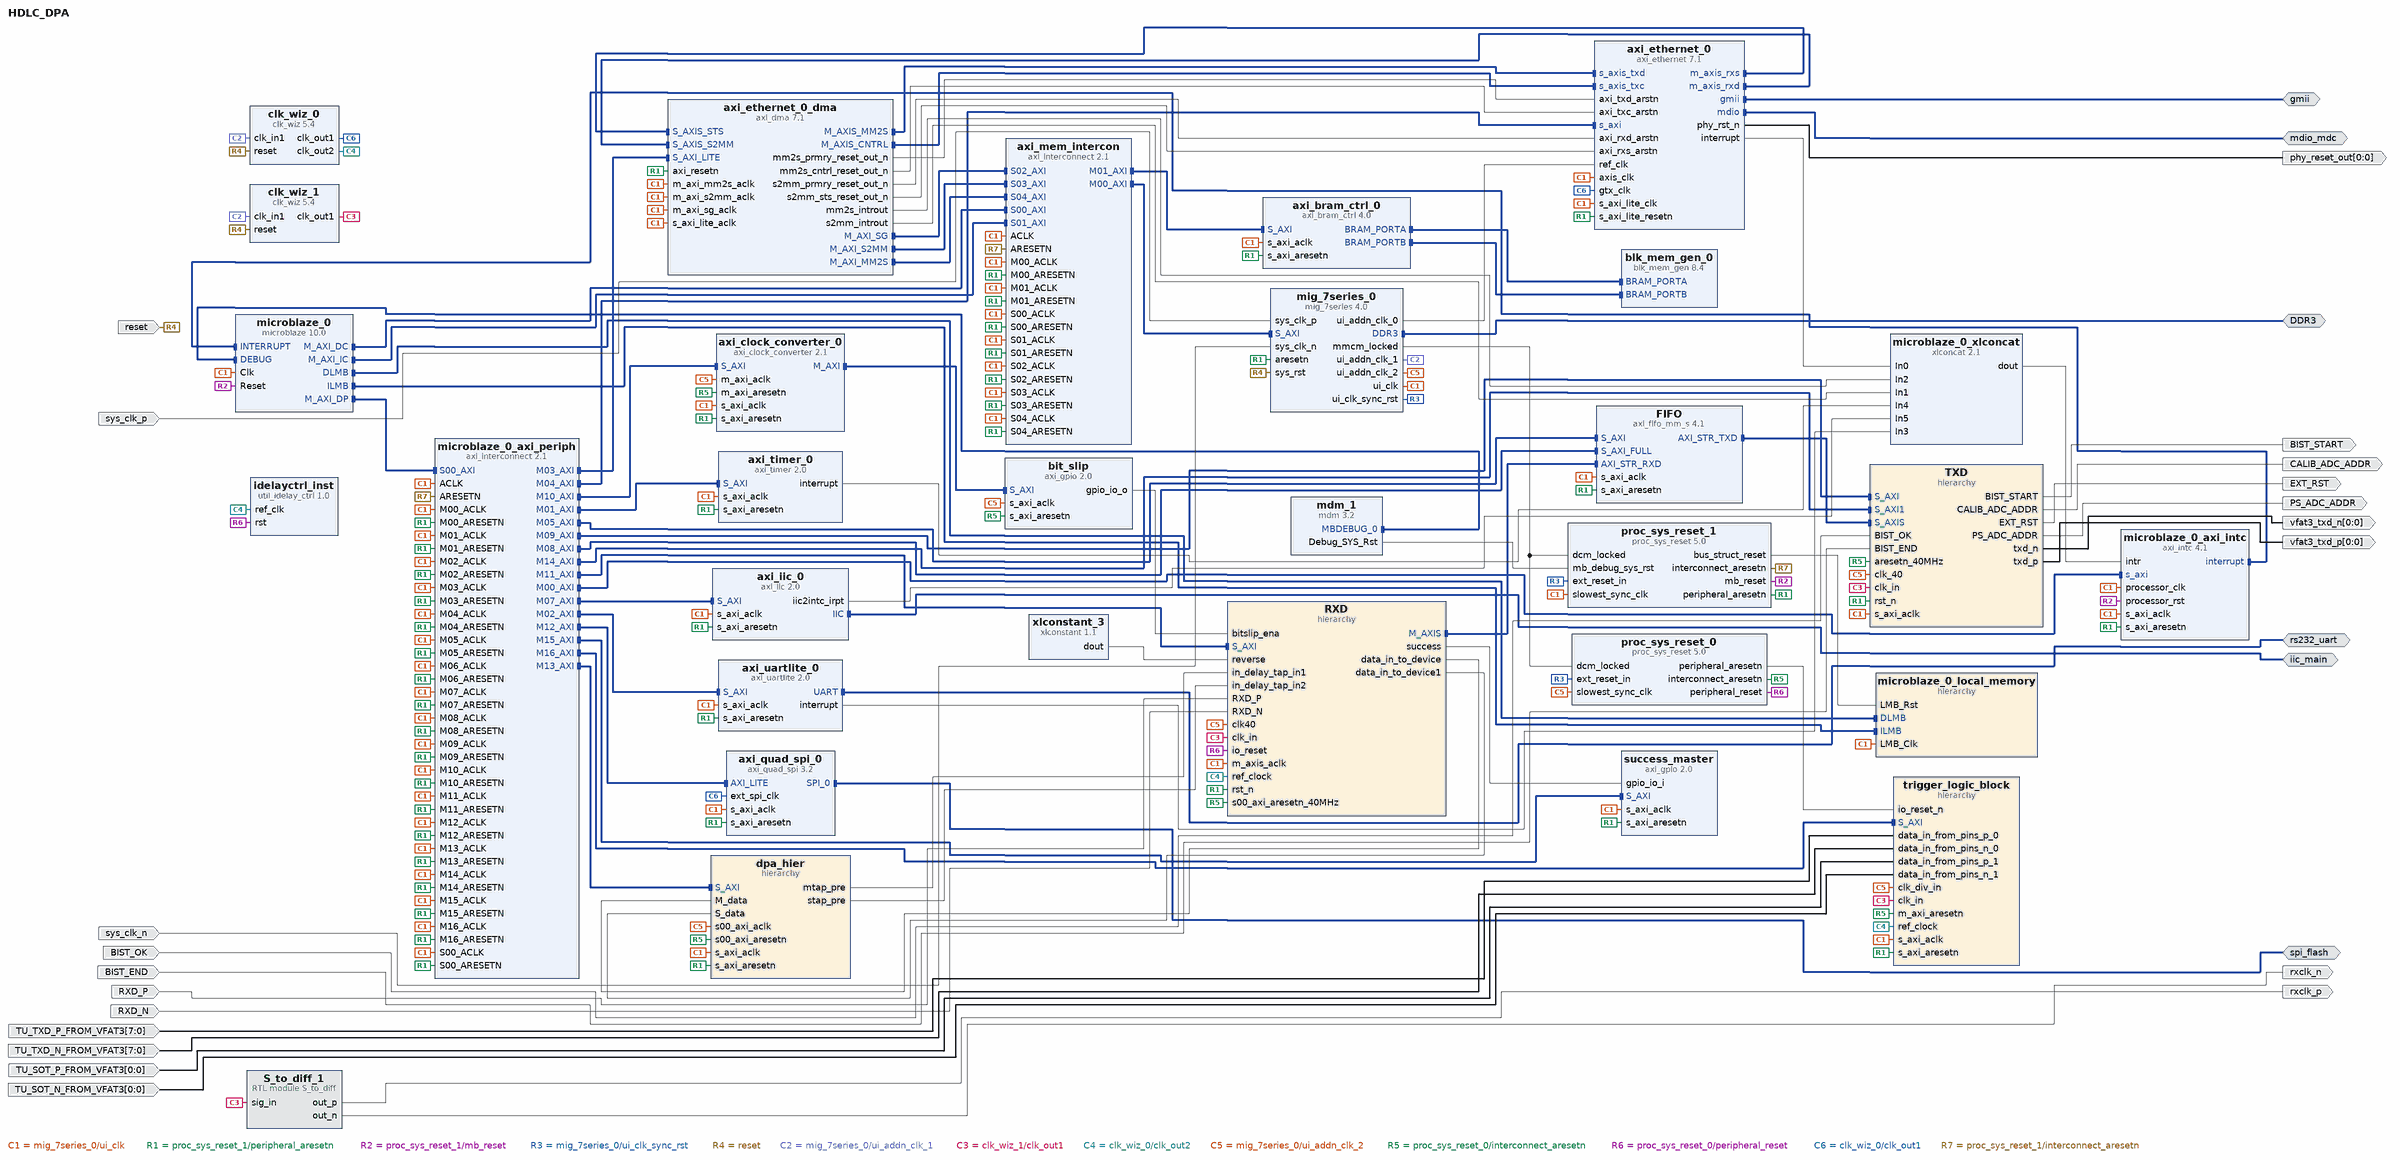
[diagram p0: block diagram of the top level]
# Vivado block design HDLC_DPA, xc7k325tffg900-2, Vivado 2017.4
create_bd_design HDLC_DPA

create_bd_intf_port -mode Master -vlnv xilinx.com:interface:uart_rtl:1.0 rs232_uart
create_bd_intf_port -mode Master -vlnv xilinx.com:interface:ddrx_rtl:1.0 DDR3
create_bd_intf_port -mode Master -vlnv xilinx.com:interface:gmii_rtl:1.0 gmii
create_bd_intf_port -mode Master -vlnv xilinx.com:interface:mdio_rtl:1.0 mdio_mdc
create_bd_intf_port -mode Master -vlnv xilinx.com:interface:iic_rtl:1.0 iic_main
create_bd_intf_port -mode Master -vlnv xilinx.com:interface:spi_rtl:1.0 spi_flash
create_bd_port -dir I sys_clk_p
create_bd_port -dir I sys_clk_n
create_bd_port -dir I -type rst reset
set_property -dict {CONFIG.POLARITY ACTIVE_HIGH} [get_bd_ports reset]
create_bd_port -dir O -from 0 -to 0 -type rst phy_reset_out
create_bd_port -dir O -from 0 -to 0 vfat3_txd_p
create_bd_port -dir O -from 0 -to 0 vfat3_txd_n
create_bd_port -dir I BIST_OK
create_bd_port -dir I BIST_END
create_bd_port -dir O BIST_START
create_bd_port -dir O PS_ADC_ADDR
create_bd_port -dir O CALIB_ADC_ADDR
create_bd_port -dir O EXT_RST
create_bd_port -dir O rxclk_p
create_bd_port -dir O rxclk_n
create_bd_port -dir I RXD_P
create_bd_port -dir I RXD_N
create_bd_port -dir I -from 7 -to 0 TU_TXD_P_FROM_VFAT3
create_bd_port -dir I -from 7 -to 0 TU_TXD_N_FROM_VFAT3
create_bd_port -dir I -from 0 -to 0 TU_SOT_P_FROM_VFAT3
create_bd_port -dir I -from 0 -to 0 TU_SOT_N_FROM_VFAT3

create_bd_cell -type hier microblaze_0_local_memory
create_bd_cell -type ip -vlnv xilinx.com:ip:axi_intc:4.1 microblaze_0_axi_intc
set_property -dict {CONFIG.C_HAS_FAST 1} [get_bd_cells microblaze_0_axi_intc]
create_bd_cell -type ip -vlnv xilinx.com:ip:xlconcat:2.1 microblaze_0_xlconcat
set_property -dict {CONFIG.NUM_PORTS 6 CONFIG.dout_width 6} [get_bd_cells microblaze_0_xlconcat]
create_bd_cell -type ip -vlnv xilinx.com:ip:axi_bram_ctrl:4.0 axi_bram_ctrl_0
set_property -dict {CONFIG.C_SELECT_XPM 0} [get_bd_cells axi_bram_ctrl_0]
create_bd_cell -type ip -vlnv xilinx.com:ip:axi_clock_converter:2.1 axi_clock_converter_0
create_bd_cell -type ip -vlnv xilinx.com:ip:axi_ethernet:7.1 axi_ethernet_0
set_property -dict [list \
  CONFIG.ETHERNET_BOARD_INTERFACE gmii \
  CONFIG.PHYRST_BOARD_INTERFACE phy_reset_out \
  CONFIG.MDIO_BOARD_INTERFACE mdio_mdc \
  CONFIG.rxnibblebitslice0used true \
  CONFIG.RXMEM 32k \
  CONFIG.TXMEM 32k \
  CONFIG.TXCSUM Full \
  CONFIG.RXCSUM Full \
] [get_bd_cells axi_ethernet_0]
create_bd_cell -type ip -vlnv xilinx.com:ip:axi_dma:7.1 axi_ethernet_0_dma
set_property -dict [list \
  CONFIG.c_include_mm2s_dre 1 \
  CONFIG.c_mm2s_burst_size 32 \
  CONFIG.c_sg_use_stsapp_length 1 \
  CONFIG.c_include_s2mm_dre 1 \
  CONFIG.c_s2mm_burst_size 32 \
] [get_bd_cells axi_ethernet_0_dma]
create_bd_cell -type ip -vlnv xilinx.com:ip:axi_fifo_mm_s:4.1 FIFO
set_property -dict [list \
  CONFIG.C_DATA_INTERFACE_TYPE 1 \
  CONFIG.C_RX_FIFO_PE_THRESHOLD 2 \
  CONFIG.C_RX_FIFO_PF_THRESHOLD 32763 \
  CONFIG.C_TX_FIFO_PE_THRESHOLD 2 \
  CONFIG.C_TX_FIFO_PF_THRESHOLD 130000 \
  CONFIG.C_RX_FIFO_DEPTH 32768 \
  CONFIG.C_TX_FIFO_DEPTH 131072 \
  CONFIG.C_HAS_AXIS_TDEST false \
  CONFIG.C_AXIS_TDEST_WIDTH 4 \
  CONFIG.C_USE_TX_DATA 1 \
  CONFIG.C_USE_TX_CTRL 0 \
] [get_bd_cells FIFO]
create_bd_cell -type ip -vlnv xilinx.com:ip:axi_gpio:2.0 bit_slip
set_property -dict {CONFIG.C_GPIO_WIDTH 1 CONFIG.C_ALL_OUTPUTS 1} [get_bd_cells bit_slip]
create_bd_cell -type ip -vlnv xilinx.com:ip:axi_iic:2.0 axi_iic_0
set_property -dict {CONFIG.USE_BOARD_FLOW true CONFIG.IIC_BOARD_INTERFACE iic_main} [get_bd_cells axi_iic_0]
create_bd_cell -type ip -vlnv xilinx.com:ip:axi_interconnect:2.1 axi_mem_intercon
set_property -dict [list \
  CONFIG.NUM_SI 5 \
  CONFIG.NUM_MI 2 \
  CONFIG.STRATEGY 2 \
  CONFIG.SYNCHRONIZATION_STAGES 2 \
  CONFIG.M00_HAS_REGSLICE 4 \
  CONFIG.M01_HAS_REGSLICE 4 \
  CONFIG.S00_HAS_REGSLICE 4 \
  CONFIG.S01_HAS_REGSLICE 4 \
  CONFIG.S02_HAS_REGSLICE 4 \
  CONFIG.S03_HAS_REGSLICE 4 \
  CONFIG.S04_HAS_REGSLICE 4 \
  CONFIG.S00_HAS_DATA_FIFO 2 \
  CONFIG.S01_HAS_DATA_FIFO 2 \
  CONFIG.S02_HAS_DATA_FIFO 2 \
  CONFIG.S03_HAS_DATA_FIFO 2 \
  CONFIG.S04_HAS_DATA_FIFO 2 \
] [get_bd_cells axi_mem_intercon]
create_bd_cell -type ip -vlnv xilinx.com:ip:axi_timer:2.0 axi_timer_0
create_bd_cell -type ip -vlnv xilinx.com:ip:axi_uartlite:2.0 axi_uartlite_0
set_property -dict [list \
  CONFIG.C_BAUDRATE 921600 \
  CONFIG.C_S_AXI_ACLK_FREQ_HZ 150150150 \
  CONFIG.USE_BOARD_FLOW true \
  CONFIG.UARTLITE_BOARD_INTERFACE rs232_uart \
] [get_bd_cells axi_uartlite_0]
create_bd_cell -type ip -vlnv xilinx.com:ip:blk_mem_gen:8.4 blk_mem_gen_0
set_property -dict [list \
  CONFIG.Memory_Type True_Dual_Port_RAM \
  CONFIG.Enable_B Use_ENB_Pin \
  CONFIG.Use_RSTB_Pin true \
  CONFIG.Port_B_Clock 100 \
  CONFIG.Port_B_Write_Rate 50 \
  CONFIG.Port_B_Enable_Rate 100 \
  CONFIG.EN_SAFETY_CKT false \
] [get_bd_cells blk_mem_gen_0]
create_bd_cell -type ip -vlnv xilinx.com:ip:clk_wiz:5.4 clk_wiz_0
set_property -dict [list \
  CONFIG.CLKIN1_JITTER_PS 83.329999999999998 \
  CONFIG.CLKOUT2_USED true \
  CONFIG.NUM_OUT_CLKS 2 \
  CONFIG.CLKOUT1_REQUESTED_OUT_FREQ 125 \
  CONFIG.CLKOUT2_REQUESTED_OUT_FREQ 200 \
  CONFIG.MMCM_DIVCLK_DIVIDE 3 \
  CONFIG.MMCM_CLKFBOUT_MULT_F 25.000 \
  CONFIG.MMCM_CLKIN1_PERIOD 8.333 \
  CONFIG.MMCM_CLKIN2_PERIOD 10.000 \
  CONFIG.MMCM_CLKOUT0_DIVIDE_F 8.000 \
  CONFIG.MMCM_CLKOUT1_DIVIDE 5 \
  CONFIG.USE_BOARD_FLOW true \
  CONFIG.RESET_BOARD_INTERFACE reset \
  CONFIG.CLKOUT1_JITTER 165.993 \
  CONFIG.CLKOUT1_PHASE_ERROR 191.950 \
  CONFIG.CLKOUT2_JITTER 153.008 \
  CONFIG.CLKOUT2_PHASE_ERROR 191.950 \
] [get_bd_cells clk_wiz_0]
create_bd_cell -type ip -vlnv xilinx.com:ip:clk_wiz:5.4 clk_wiz_1
set_property -dict [list \
  CONFIG.CLKIN1_JITTER_PS 83.329999999999998 \
  CONFIG.CLKOUT2_USED true \
  CONFIG.CLKOUT3_USED true \
  CONFIG.CLKOUT4_USED true \
  CONFIG.NUM_OUT_CLKS 4 \
  CONFIG.CLKOUT1_REQUESTED_OUT_FREQ 320 \
  CONFIG.CLKOUT2_REQUESTED_OUT_FREQ 320 \
  CONFIG.CLKOUT2_REQUESTED_PHASE 0 \
  CONFIG.CLKOUT3_REQUESTED_OUT_FREQ 40 \
  CONFIG.CLKOUT4_REQUESTED_OUT_FREQ 200 \
  CONFIG.PRIM_SOURCE Single_ended_clock_capable_pin \
  CONFIG.MMCM_DIVCLK_DIVIDE 1 \
  CONFIG.MMCM_CLKFBOUT_MULT_F 8.000 \
  CONFIG.MMCM_CLKIN1_PERIOD 8.333 \
  CONFIG.MMCM_CLKIN2_PERIOD 10.000 \
  CONFIG.MMCM_CLKOUT0_DIVIDE_F 3.000 \
  CONFIG.MMCM_CLKOUT1_DIVIDE 3 \
  CONFIG.MMCM_CLKOUT1_PHASE 0.000 \
  CONFIG.MMCM_CLKOUT2_DIVIDE 24 \
  CONFIG.MMCM_CLKOUT3_DIVIDE 5 \
  CONFIG.USE_BOARD_FLOW true \
  CONFIG.CLK_IN1_BOARD_INTERFACE Custom \
  CONFIG.RESET_BOARD_INTERFACE reset \
  CONFIG.CLKOUT1_JITTER 102.742 \
  CONFIG.CLKOUT1_PHASE_ERROR 99.820 \
  CONFIG.CLKOUT2_JITTER 102.742 \
  CONFIG.CLKOUT2_PHASE_ERROR 99.820 \
  CONFIG.CLKOUT3_JITTER 154.911 \
  CONFIG.CLKOUT3_PHASE_ERROR 99.820 \
  CONFIG.CLKOUT4_JITTER 113.061 \
  CONFIG.CLKOUT4_PHASE_ERROR 99.820 \
] [get_bd_cells clk_wiz_1]
create_bd_cell -type ip -vlnv xilinx.com:ip:mdm:3.2 mdm_1
create_bd_cell -type ip -vlnv xilinx.com:ip:microblaze:10.0 microblaze_0
set_property -dict [list \
  CONFIG.C_AREA_OPTIMIZED 0 \
  CONFIG.C_D_AXI 1 \
  CONFIG.C_I_AXI 0 \
  CONFIG.C_ENABLE_DISCRETE_PORTS 0 \
  CONFIG.G_TEMPLATE_LIST 3 \
  CONFIG.G_USE_EXCEPTIONS 0 \
  CONFIG.C_USE_MSR_INSTR 1 \
  CONFIG.C_USE_PCMP_INSTR 1 \
  CONFIG.C_USE_BARREL 1 \
  CONFIG.C_USE_DIV 1 \
  CONFIG.C_USE_HW_MUL 2 \
  CONFIG.C_USE_FPU 2 \
  CONFIG.C_DEBUG_ENABLED 1 \
  CONFIG.C_FSL_LINKS 1 \
  CONFIG.C_USE_EXTENDED_FSL_INSTR 1 \
  CONFIG.C_USE_ICACHE 1 \
  CONFIG.C_ADDR_TAG_BITS 19 \
  CONFIG.C_CACHE_BYTE_SIZE 4096 \
  CONFIG.C_ICACHE_LINE_LEN 4 \
  CONFIG.C_ICACHE_VICTIMS 0 \
  CONFIG.C_ICACHE_STREAMS 0 \
  CONFIG.C_USE_DCACHE 1 \
  CONFIG.C_DCACHE_ADDR_TAG 19 \
  CONFIG.C_DCACHE_BYTE_SIZE 4096 \
  CONFIG.C_DCACHE_LINE_LEN 4 \
  CONFIG.C_DCACHE_USE_WRITEBACK 0 \
  CONFIG.C_USE_MMU 3 \
  CONFIG.C_MMU_DTLB_SIZE 2 \
  CONFIG.C_MMU_ITLB_SIZE 1 \
  CONFIG.C_MMU_ZONES 2 \
  CONFIG.C_USE_BRANCH_TARGET_CACHE 1 \
] [get_bd_cells microblaze_0]
create_bd_cell -type ip -vlnv xilinx.com:ip:axi_interconnect:2.1 microblaze_0_axi_periph
set_property -dict {CONFIG.NUM_SI 1 CONFIG.NUM_MI 17 CONFIG.SYNCHRONIZATION_STAGES 2} [get_bd_cells microblaze_0_axi_periph]
create_bd_cell -type ip -vlnv xilinx.com:ip:mig_7series:4.0 mig_7series_0
set_property -dict [list \
  CONFIG.XML_INPUT_FILE mig_b.prj \
  CONFIG.RESET_BOARD_INTERFACE reset \
  CONFIG.MIG_DONT_TOUCH_PARAM Custom \
  CONFIG.BOARD_MIG_PARAM Custom \
] [get_bd_cells mig_7series_0]
create_bd_cell -type ip -vlnv xilinx.com:ip:proc_sys_reset:5.0 proc_sys_reset_1
create_bd_cell -type ip -vlnv xilinx.com:ip:xlconstant:1.1 xlconstant_3
create_bd_cell -type ip -vlnv xilinx.com:ip:axi_quad_spi:3.2 axi_quad_spi_0
set_property -dict {CONFIG.USE_BOARD_FLOW true CONFIG.QSPI_BOARD_INTERFACE spi_flash} [get_bd_cells axi_quad_spi_0]
create_bd_cell -type hier RXD
create_bd_cell -type hier TXD
create_bd_cell -type ip -vlnv xilinx.com:ip:proc_sys_reset:5.0 proc_sys_reset_0
create_bd_cell -type module -reference S_to_diff S_to_diff_1
create_bd_cell -type hier dpa_hier
create_bd_cell -type ip -vlnv xilinx.com:ip:axi_gpio:2.0 success_master
set_property -dict {CONFIG.C_GPIO_WIDTH 1 CONFIG.C_ALL_INPUTS 1} [get_bd_cells success_master]
create_bd_cell -type hier trigger_logic_block
create_bd_cell -type ip -vlnv xilinx.com:ip:util_idelay_ctrl:1.0 idelayctrl_inst

# ---- hierarchy /microblaze_0_local_memory ----
current_bd_instance /microblaze_0_local_memory
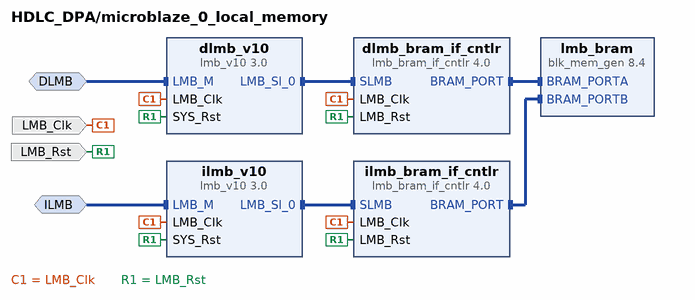
[diagram p1: block diagram inside /microblaze_0_local_memory]
create_bd_intf_pin -mode MirroredMaster -vlnv xilinx.com:interface:lmb_rtl:1.0 DLMB
create_bd_intf_pin -mode MirroredMaster -vlnv xilinx.com:interface:lmb_rtl:1.0 ILMB
create_bd_pin -dir I LMB_Clk
create_bd_pin -dir I LMB_Rst

create_bd_cell -type ip -vlnv xilinx.com:ip:lmb_v10:3.0 dlmb_v10
create_bd_cell -type ip -vlnv xilinx.com:ip:lmb_v10:3.0 ilmb_v10
create_bd_cell -type ip -vlnv xilinx.com:ip:lmb_bram_if_cntlr:4.0 dlmb_bram_if_cntlr
create_bd_cell -type ip -vlnv xilinx.com:ip:lmb_bram_if_cntlr:4.0 ilmb_bram_if_cntlr
create_bd_cell -type ip -vlnv xilinx.com:ip:blk_mem_gen:8.4 lmb_bram
set_property -dict [list \
  CONFIG.Memory_Type True_Dual_Port_RAM \
  CONFIG.Enable_B Use_ENB_Pin \
  CONFIG.Use_RSTB_Pin true \
  CONFIG.Port_B_Clock 100 \
  CONFIG.Port_B_Write_Rate 50 \
  CONFIG.Port_B_Enable_Rate 100 \
  CONFIG.EN_SAFETY_CKT false \
] [get_bd_cells lmb_bram]

# ---- hierarchy /RXD ----
current_bd_instance /RXD
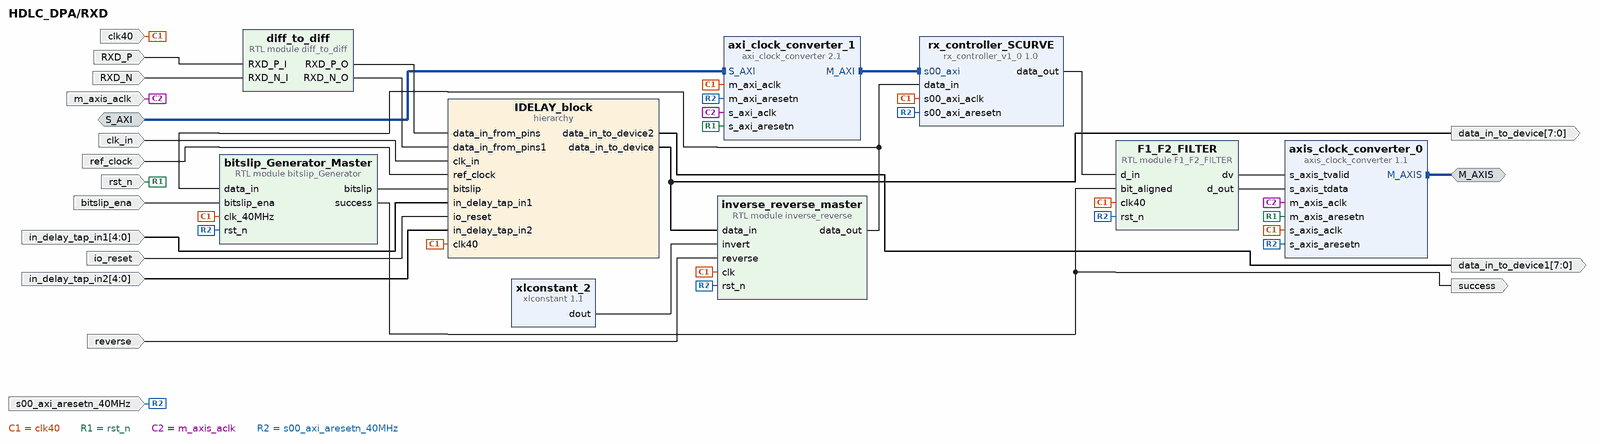
[diagram p2: block diagram inside /RXD]
create_bd_intf_pin -mode Master -vlnv xilinx.com:interface:axis_rtl:1.0 M_AXIS
create_bd_intf_pin -mode Slave -vlnv xilinx.com:interface:aximm_rtl:1.0 S_AXI
create_bd_pin -dir I clk40
create_bd_pin -dir I -type rst rst_n
create_bd_pin -dir I reverse
create_bd_pin -dir O success
create_bd_pin -dir I -type clk clk_in
create_bd_pin -dir I ref_clock
create_bd_pin -dir I RXD_P
create_bd_pin -dir I RXD_N
create_bd_pin -dir I bitslip_ena
create_bd_pin -dir I -type clk m_axis_aclk
create_bd_pin -dir I -type rst s00_axi_aresetn_40MHz
create_bd_pin -dir O -from 7 -to 0 -type data data_in_to_device
create_bd_pin -dir I -from 4 -to 0 in_delay_tap_in1
create_bd_pin -dir I -type rst io_reset
create_bd_pin -dir O -from 7 -to 0 -type data data_in_to_device1
create_bd_pin -dir I -from 4 -to 0 in_delay_tap_in2

create_bd_cell -type module -reference inverse_reverse inverse_reverse_master
create_bd_cell -type module -reference diff_to_diff diff_to_diff
create_bd_cell -type ip -vlnv xilinx.com:ip:axis_clock_converter:1.1 axis_clock_converter_0
set_property -dict {CONFIG.TDATA_NUM_BYTES 4} [get_bd_cells axis_clock_converter_0]
create_bd_cell -type ip -vlnv xilinx.com:ip:axi_clock_converter:2.1 axi_clock_converter_1
create_bd_cell -type hier IDELAY_block
create_bd_cell -type ip -vlnv xilinx.com:ip:xlconstant:1.1 xlconstant_2
set_property -dict {CONFIG.CONST_VAL 0} [get_bd_cells xlconstant_2]
create_bd_cell -type ip -vlnv cern.ch:user:rx_controller_v1_0:1.0 rx_controller_SCURVE
create_bd_cell -type module -reference bitslip_Generator bitslip_Generator_Master
create_bd_cell -type module -reference F1_F2_FILTER F1_F2_FILTER

# ---- hierarchy /RXD/IDELAY_block ----
current_bd_instance /RXD/IDELAY_block
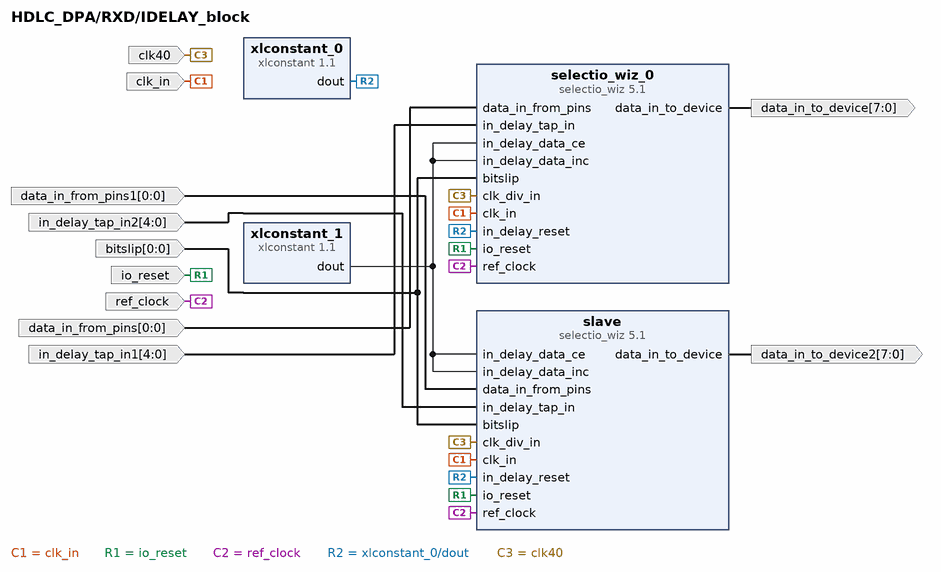
[diagram p3: block diagram inside /RXD/IDELAY_block]
create_bd_pin -dir I -from 0 -to 0 data_in_from_pins
create_bd_pin -dir I -type clk clk_in
create_bd_pin -dir I clk40
create_bd_pin -dir I -type rst io_reset
create_bd_pin -dir I ref_clock
create_bd_pin -dir I -from 0 -to 0 bitslip
create_bd_pin -dir O -from 7 -to 0 -type data data_in_to_device
create_bd_pin -dir I -from 4 -to 0 in_delay_tap_in1
create_bd_pin -dir I -from 0 -to 0 data_in_from_pins1
create_bd_pin -dir I -from 4 -to 0 in_delay_tap_in2
create_bd_pin -dir O -from 7 -to 0 -type data data_in_to_device2

create_bd_cell -type ip -vlnv xilinx.com:ip:xlconstant:1.1 xlconstant_0
create_bd_cell -type ip -vlnv xilinx.com:ip:selectio_wiz:5.1 slave
set_property -dict [list \
  CONFIG.BUS_IO_STD LVCMOS25 \
  CONFIG.USE_SERIALIZATION true \
  CONFIG.SERIALIZATION_FACTOR 8 \
  CONFIG.SYSTEM_DATA_WIDTH 1 \
  CONFIG.SELIO_INTERFACE_TYPE NETWORKING \
  CONFIG.SELIO_BUS_IN_DELAY VAR_LOADABLE \
  CONFIG.SELIO_CLK_IO_STD LVCMOS25 \
  CONFIG.SELIO_CLK_BUF MMCM \
  CONFIG.CLK_FWD_IO_STD LVCMOS25 \
  CONFIG.INCLUDE_IDELAYCTRL true \
  CONFIG.INCLUDE_IDELAYCTRL_BUFG false \
  CONFIG.IDELAY_HIGH_PERF_MODE true \
] [get_bd_cells slave]
create_bd_cell -type ip -vlnv xilinx.com:ip:xlconstant:1.1 xlconstant_1
set_property -dict {CONFIG.CONST_VAL 0} [get_bd_cells xlconstant_1]
create_bd_cell -type ip -vlnv xilinx.com:ip:selectio_wiz:5.1 selectio_wiz_0
set_property -dict [list \
  CONFIG.BUS_IO_STD LVCMOS25 \
  CONFIG.USE_SERIALIZATION true \
  CONFIG.SERIALIZATION_FACTOR 8 \
  CONFIG.SYSTEM_DATA_WIDTH 1 \
  CONFIG.SELIO_INTERFACE_TYPE NETWORKING \
  CONFIG.SELIO_BUS_IN_DELAY VAR_LOADABLE \
  CONFIG.SELIO_CLK_IO_STD LVCMOS25 \
  CONFIG.SELIO_CLK_BUF MMCM \
  CONFIG.CLK_FWD_IO_STD LVCMOS25 \
] [get_bd_cells selectio_wiz_0]

# ---- hierarchy /TXD ----
current_bd_instance /TXD
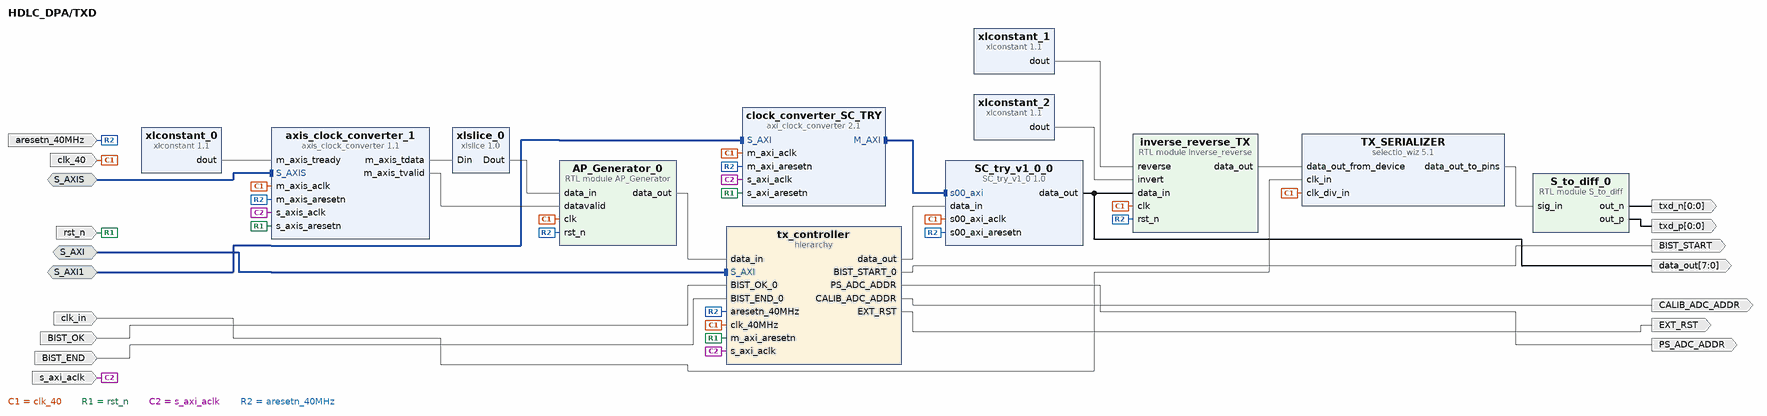
[diagram p4: block diagram inside /TXD]
create_bd_intf_pin -mode Slave -vlnv xilinx.com:interface:axis_rtl:1.0 S_AXIS
create_bd_intf_pin -mode Slave -vlnv xilinx.com:interface:aximm_rtl:1.0 S_AXI
create_bd_intf_pin -mode Slave -vlnv xilinx.com:interface:aximm_rtl:1.0 S_AXI1
create_bd_pin -dir I -type clk clk_in
create_bd_pin -dir I -type clk clk_40
create_bd_pin -dir I -type rst rst_n
create_bd_pin -dir O -from 0 -to 0 txd_p
create_bd_pin -dir O -from 0 -to 0 txd_n
create_bd_pin -dir I -type clk s_axi_aclk
create_bd_pin -dir I BIST_OK
create_bd_pin -dir I BIST_END
create_bd_pin -dir O BIST_START
create_bd_pin -dir O PS_ADC_ADDR
create_bd_pin -dir O CALIB_ADC_ADDR
create_bd_pin -dir O -type rst EXT_RST
create_bd_pin -dir I -type rst aresetn_40MHz
create_bd_pin -dir O -from 7 -to 0 data_out

create_bd_cell -type ip -vlnv xilinx.com:ip:selectio_wiz:5.1 TX_SERIALIZER
set_property -dict [list \
  CONFIG.BUS_DIR OUTPUTS \
  CONFIG.BUS_SIG_TYPE SINGLE \
  CONFIG.BUS_IO_STD LVCMOS25 \
  CONFIG.USE_SERIALIZATION true \
  CONFIG.SERIALIZATION_FACTOR 8 \
  CONFIG.SYSTEM_DATA_WIDTH 1 \
  CONFIG.SELIO_INTERFACE_TYPE NETWORKING \
  CONFIG.SELIO_BUS_IN_DELAY NONE \
  CONFIG.SELIO_CLK_SIG_TYPE SINGLE \
  CONFIG.SELIO_CLK_IO_STD LVCMOS25 \
  CONFIG.SELIO_CLK_BUF MMCM \
  CONFIG.CLK_FWD false \
  CONFIG.CLK_FWD_SER false \
  CONFIG.CLK_EN false \
  CONFIG.CONFIG_CLK_FWD false \
  CONFIG.CLK_FWD_SIG_TYPE DIFF \
  CONFIG.CLK_FWD_IO_STD LVDS_25 \
] [get_bd_cells TX_SERIALIZER]
create_bd_cell -type ip -vlnv xilinx.com:ip:xlslice:1.0 xlslice_0
set_property -dict {CONFIG.DIN_TO 0 CONFIG.DIN_FROM 7 CONFIG.DOUT_WIDTH 8} [get_bd_cells xlslice_0]
create_bd_cell -type module -reference AP_Generator AP_Generator_0
create_bd_cell -type module -reference inverse_reverse inverse_reverse_TX
create_bd_cell -type ip -vlnv xilinx.com:ip:axis_clock_converter:1.1 axis_clock_converter_1
create_bd_cell -type hier tx_controller
create_bd_cell -type ip -vlnv xilinx.com:ip:xlconstant:1.1 xlconstant_1
create_bd_cell -type ip -vlnv xilinx.com:ip:xlconstant:1.1 xlconstant_0
create_bd_cell -type ip -vlnv cern.ch:user:SC_try_v1_0:1.0 SC_try_v1_0_0
create_bd_cell -type ip -vlnv xilinx.com:ip:axi_clock_converter:2.1 clock_converter_SC_TRY
create_bd_cell -type module -reference S_to_diff S_to_diff_0
create_bd_cell -type ip -vlnv xilinx.com:ip:xlconstant:1.1 xlconstant_2
set_property -dict {CONFIG.CONST_VAL 0} [get_bd_cells xlconstant_2]

# ---- hierarchy /TXD/tx_controller ----
current_bd_instance /TXD/tx_controller
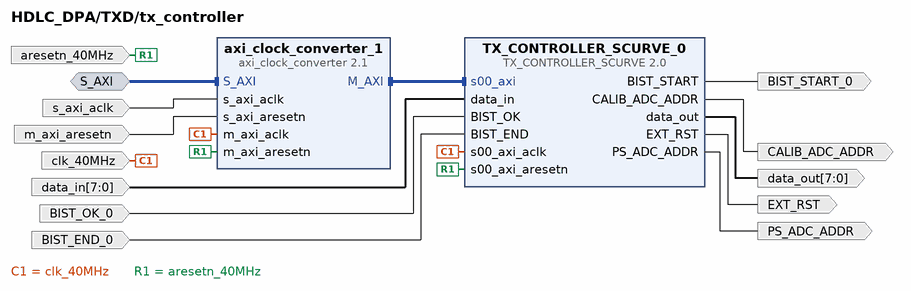
[diagram p5: block diagram inside /TXD/tx_controller]
create_bd_intf_pin -mode Slave -vlnv xilinx.com:interface:aximm_rtl:1.0 S_AXI
create_bd_pin -dir I -type clk s_axi_aclk
create_bd_pin -dir I -type rst m_axi_aresetn
create_bd_pin -dir I clk_40MHz
create_bd_pin -dir O -from 7 -to 0 data_out
create_bd_pin -dir I -from 7 -to 0 data_in
create_bd_pin -dir I BIST_OK_0
create_bd_pin -dir I BIST_END_0
create_bd_pin -dir O BIST_START_0
create_bd_pin -dir O PS_ADC_ADDR
create_bd_pin -dir O CALIB_ADC_ADDR
create_bd_pin -dir O -type rst EXT_RST
create_bd_pin -dir I -type rst aresetn_40MHz

create_bd_cell -type ip -vlnv xilinx.com:ip:axi_clock_converter:2.1 axi_clock_converter_1
create_bd_cell -type ip -vlnv cern.ch:user:TX_CONTROLLER_SCURVE:2.0 TX_CONTROLLER_SCURVE_0

# ---- hierarchy /dpa_hier ----
current_bd_instance /dpa_hier
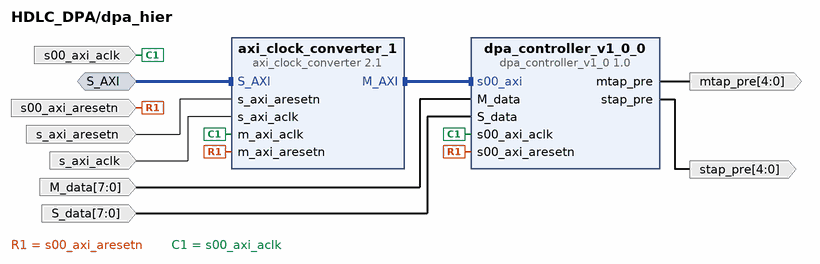
[diagram p6: block diagram inside /dpa_hier]
create_bd_intf_pin -mode Slave -vlnv xilinx.com:interface:aximm_rtl:1.0 S_AXI
create_bd_pin -dir I -type rst s00_axi_aresetn
create_bd_pin -dir I -type clk s00_axi_aclk
create_bd_pin -dir I -type rst s_axi_aresetn
create_bd_pin -dir I -type clk s_axi_aclk
create_bd_pin -dir O -from 4 -to 0 mtap_pre
create_bd_pin -dir I -from 7 -to 0 M_data
create_bd_pin -dir I -from 7 -to 0 -type data S_data
create_bd_pin -dir O -from 4 -to 0 stap_pre

create_bd_cell -type ip -vlnv xilinx.com:ip:axi_clock_converter:2.1 axi_clock_converter_1
create_bd_cell -type ip -vlnv cern.ch:user:dpa_controller_v1_0:1.0 dpa_controller_v1_0_0

# ---- hierarchy /trigger_logic_block ----
current_bd_instance /trigger_logic_block
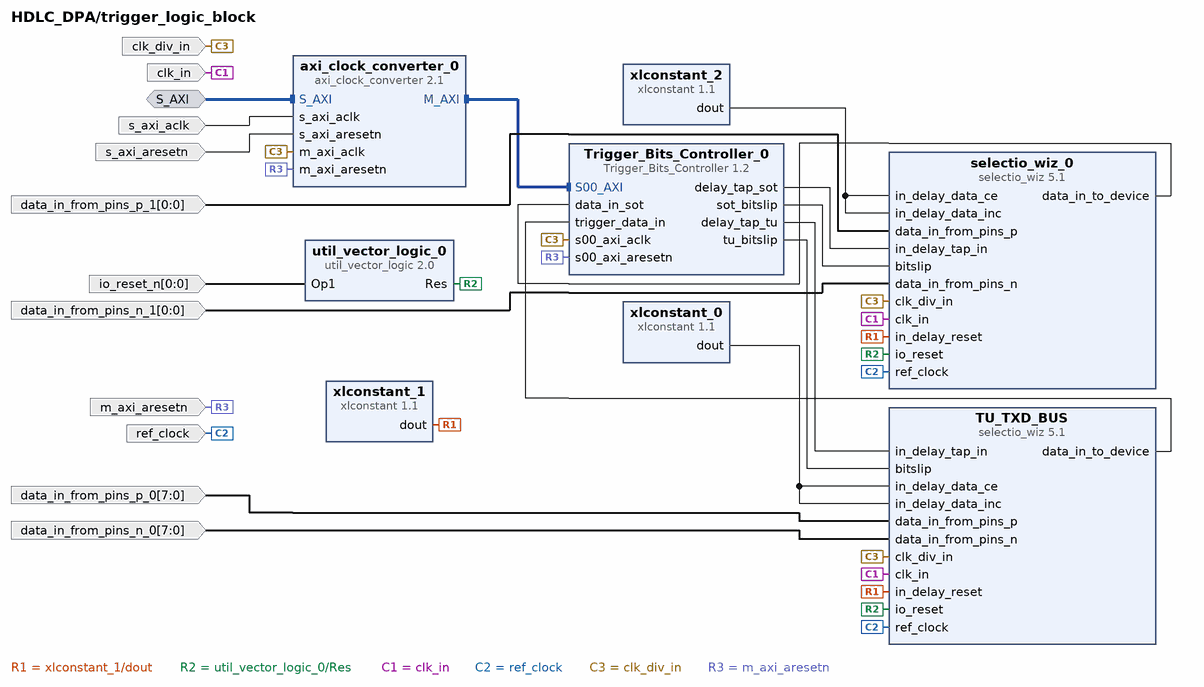
[diagram p7: block diagram inside /trigger_logic_block]
create_bd_intf_pin -mode Slave -vlnv xilinx.com:interface:aximm_rtl:1.0 S_AXI
create_bd_pin -dir I -type clk clk_in
create_bd_pin -dir I -type clk s_axi_aclk
create_bd_pin -dir I -from 0 -to 0 io_reset_n
create_bd_pin -dir I clk_div_in
create_bd_pin -dir I ref_clock
create_bd_pin -dir I -type rst m_axi_aresetn
create_bd_pin -dir I -type rst s_axi_aresetn
create_bd_pin -dir I -from 7 -to 0 data_in_from_pins_p_0
create_bd_pin -dir I -from 7 -to 0 data_in_from_pins_n_0
create_bd_pin -dir I -from 0 -to 0 data_in_from_pins_p_1
create_bd_pin -dir I -from 0 -to 0 data_in_from_pins_n_1

create_bd_cell -type ip -vlnv xilinx.com:ip:selectio_wiz:5.1 TU_TXD_BUS
set_property -dict [list \
  CONFIG.BUS_SIG_TYPE DIFF \
  CONFIG.BUS_IO_STD LVDS_25 \
  CONFIG.USE_SERIALIZATION true \
  CONFIG.SERIALIZATION_FACTOR 8 \
  CONFIG.SYSTEM_DATA_WIDTH 8 \
  CONFIG.SELIO_INTERFACE_TYPE NETWORKING \
  CONFIG.SELIO_BUS_IN_DELAY VAR_LOADABLE \
  CONFIG.SELIO_CLK_SIG_TYPE DIFF \
  CONFIG.SELIO_CLK_IO_STD LVDS_25 \
  CONFIG.SELIO_CLK_BUF MMCM \
  CONFIG.CLK_FWD_SIG_TYPE DIFF \
  CONFIG.CLK_FWD_IO_STD LVDS_25 \
] [get_bd_cells TU_TXD_BUS]
create_bd_cell -type ip -vlnv xilinx.com:ip:xlconstant:1.1 xlconstant_0
set_property -dict {CONFIG.CONST_WIDTH 8 CONFIG.CONST_VAL 0} [get_bd_cells xlconstant_0]
create_bd_cell -type ip -vlnv xilinx.com:ip:xlconstant:1.1 xlconstant_1
create_bd_cell -type ip -vlnv xilinx.com:ip:util_vector_logic:2.0 util_vector_logic_0
set_property -dict {CONFIG.C_SIZE 1 CONFIG.C_OPERATION not} [get_bd_cells util_vector_logic_0]
create_bd_cell -type ip -vlnv xilinx.com:ip:axi_clock_converter:2.1 axi_clock_converter_0
create_bd_cell -type ip -vlnv xilinx.com:ip:selectio_wiz:5.1 selectio_wiz_0
set_property -dict [list \
  CONFIG.BUS_SIG_TYPE DIFF \
  CONFIG.BUS_IO_STD LVDS_25 \
  CONFIG.USE_SERIALIZATION true \
  CONFIG.SERIALIZATION_FACTOR 8 \
  CONFIG.SYSTEM_DATA_WIDTH 1 \
  CONFIG.SELIO_INTERFACE_TYPE NETWORKING \
  CONFIG.SELIO_BUS_IN_DELAY VAR_LOADABLE \
  CONFIG.SELIO_CLK_SIG_TYPE DIFF \
  CONFIG.SELIO_CLK_IO_STD LVDS_25 \
  CONFIG.SELIO_CLK_BUF MMCM \
  CONFIG.CLK_FWD_SIG_TYPE DIFF \
  CONFIG.CLK_FWD_IO_STD LVDS_25 \
] [get_bd_cells selectio_wiz_0]
create_bd_cell -type ip -vlnv xilinx.com:ip:xlconstant:1.1 xlconstant_2
set_property -dict {CONFIG.CONST_VAL 0} [get_bd_cells xlconstant_2]
create_bd_cell -type ip -vlnv ULB:user:Trigger_Bits_Controller:1.2 Trigger_Bits_Controller_0

# ---- connections ----

current_bd_instance /microblaze_0_local_memory
connect_bd_intf_net -intf_net microblaze_0_dlmb_bus [get_bd_intf_pins dlmb_v10/LMB_Sl_0] [get_bd_intf_pins dlmb_bram_if_cntlr/SLMB]
connect_bd_intf_net -intf_net microblaze_0_ilmb_bus [get_bd_intf_pins ilmb_v10/LMB_Sl_0] [get_bd_intf_pins ilmb_bram_if_cntlr/SLMB]
connect_bd_intf_net -intf_net microblaze_0_dlmb_cntlr [get_bd_intf_pins dlmb_bram_if_cntlr/BRAM_PORT] [get_bd_intf_pins lmb_bram/BRAM_PORTA]
connect_bd_intf_net -intf_net microblaze_0_ilmb_cntlr [get_bd_intf_pins ilmb_bram_if_cntlr/BRAM_PORT] [get_bd_intf_pins lmb_bram/BRAM_PORTB]
connect_bd_intf_net -intf_net microblaze_0_dlmb [get_bd_intf_pins DLMB] [get_bd_intf_pins dlmb_v10/LMB_M]
connect_bd_intf_net -intf_net microblaze_0_ilmb [get_bd_intf_pins ILMB] [get_bd_intf_pins ilmb_v10/LMB_M]
connect_bd_net -net microblaze_0_Clk [get_bd_pins LMB_Clk] \
  [get_bd_pins dlmb_v10/LMB_Clk] [get_bd_pins ilmb_v10/LMB_Clk] [get_bd_pins dlmb_bram_if_cntlr/LMB_Clk] \
  [get_bd_pins ilmb_bram_if_cntlr/LMB_Clk]
connect_bd_net -net proc_sys_reset_1_bus_struct_reset [get_bd_pins LMB_Rst] \
  [get_bd_pins dlmb_v10/SYS_Rst] [get_bd_pins ilmb_v10/SYS_Rst] [get_bd_pins dlmb_bram_if_cntlr/LMB_Rst] \
  [get_bd_pins ilmb_bram_if_cntlr/LMB_Rst]

current_bd_instance /RXD
connect_bd_intf_net [get_bd_intf_pins axi_clock_converter_1/M_AXI] [get_bd_intf_pins rx_controller_SCURVE/s00_axi]
connect_bd_intf_net -intf_net Receiver_logic_M_AXIS [get_bd_intf_pins M_AXIS] [get_bd_intf_pins axis_clock_converter_0/M_AXIS]
connect_bd_intf_net [get_bd_intf_pins S_AXI] [get_bd_intf_pins axi_clock_converter_1/S_AXI]
connect_bd_net -net F1_F2_IN [get_bd_pins inverse_reverse_master/data_out] \
  [get_bd_pins rx_controller_SCURVE/data_in] [get_bd_pins bitslip_Generator_Master/data_in]
connect_bd_net -net Receiver_logic_dv [get_bd_pins F1_F2_FILTER/dv] [get_bd_pins axis_clock_converter_0/s_axis_tvalid]
connect_bd_net -net diff_to_diff_0_RXD_P_O [get_bd_pins diff_to_diff/RXD_P_O] [get_bd_pins IDELAY_block/data_in_from_pins]
connect_bd_net -net Receiver_logic_data_in_to_device [get_bd_pins IDELAY_block/data_in_to_device] \
  [get_bd_pins data_in_to_device] [get_bd_pins inverse_reverse_master/data_in]
connect_bd_net -net CLK_40mhZ [get_bd_pins clk40] \
  [get_bd_pins axis_clock_converter_0/s_axis_aclk] [get_bd_pins inverse_reverse_master/clk] \
  [get_bd_pins axi_clock_converter_1/m_axi_aclk] [get_bd_pins rx_controller_SCURVE/s00_axi_aclk] \
  [get_bd_pins bitslip_Generator_Master/clk_40MHz] [get_bd_pins F1_F2_FILTER/clk40] [get_bd_pins IDELAY_block/clk40]
connect_bd_net -net proc_sys_reset_1_peripheral_aresetn [get_bd_pins rst_n] \
  [get_bd_pins axi_clock_converter_1/s_axi_aresetn] [get_bd_pins axis_clock_converter_0/m_axis_aresetn]
connect_bd_net -net xlconstant_3_dout [get_bd_pins reverse] [get_bd_pins inverse_reverse_master/reverse]
connect_bd_net -net tx_controller_hier_INV_RX [get_bd_pins xlconstant_2/dout] [get_bd_pins inverse_reverse_master/invert]
connect_bd_net -net clk_wiz_1_clk_out1 [get_bd_pins clk_in] [get_bd_pins IDELAY_block/clk_in]
connect_bd_net -net clk_wiz_0_clk_out2 [get_bd_pins ref_clock] [get_bd_pins IDELAY_block/ref_clock]
connect_bd_net [get_bd_pins RXD_P] [get_bd_pins diff_to_diff/RXD_P_I]
connect_bd_net [get_bd_pins RXD_N] [get_bd_pins diff_to_diff/RXD_N_I]
connect_bd_net -net Receiver_logic_gpio_io_o1 [get_bd_pins bitslip_ena] [get_bd_pins bitslip_Generator_Master/bitslip_ena]
connect_bd_net -net microblaze_0_Clk [get_bd_pins m_axis_aclk] \
  [get_bd_pins axis_clock_converter_0/m_axis_aclk] [get_bd_pins axi_clock_converter_1/s_axi_aclk]
connect_bd_net -net s00_axi_aresetn_1 [get_bd_pins s00_axi_aresetn_40MHz] \
  [get_bd_pins axi_clock_converter_1/m_axi_aresetn] [get_bd_pins inverse_reverse_master/rst_n] \
  [get_bd_pins axis_clock_converter_0/s_axis_aresetn] [get_bd_pins rx_controller_SCURVE/s00_axi_aresetn] \
  [get_bd_pins bitslip_Generator_Master/rst_n] [get_bd_pins F1_F2_FILTER/rst_n]
connect_bd_net -net in_delay_tap_in1_1 [get_bd_pins in_delay_tap_in1] [get_bd_pins IDELAY_block/in_delay_tap_in1]
connect_bd_net -net rx_controller_v1_0_0_data_out [get_bd_pins rx_controller_SCURVE/data_out] [get_bd_pins F1_F2_FILTER/d_in]
connect_bd_net [get_bd_pins io_reset] [get_bd_pins IDELAY_block/io_reset]
connect_bd_net [get_bd_pins diff_to_diff/RXD_N_O] [get_bd_pins IDELAY_block/data_in_from_pins1]
connect_bd_net -net in_delay_tap_in2_1 [get_bd_pins in_delay_tap_in2] [get_bd_pins IDELAY_block/in_delay_tap_in2]
connect_bd_net [get_bd_pins IDELAY_block/data_in_to_device2] [get_bd_pins data_in_to_device1]
connect_bd_net [get_bd_pins bitslip_Generator_Master/success] [get_bd_pins success] [get_bd_pins F1_F2_FILTER/bit_aligned]
connect_bd_net -net bitslip_1 [get_bd_pins bitslip_Generator_Master/bitslip] [get_bd_pins IDELAY_block/bitslip]
connect_bd_net -net F1_F2_OUT [get_bd_pins F1_F2_FILTER/d_out] [get_bd_pins axis_clock_converter_0/s_axis_tdata]

current_bd_instance /RXD/IDELAY_block
connect_bd_net -net clk_wiz_1_clk_out1 [get_bd_pins clk_in] [get_bd_pins slave/clk_in] [get_bd_pins selectio_wiz_0/clk_in]
connect_bd_net -net util_vector_logic_0_Res [get_bd_pins io_reset] [get_bd_pins slave/io_reset] [get_bd_pins selectio_wiz_0/io_reset]
connect_bd_net -net clk_wiz_0_clk_out2 [get_bd_pins ref_clock] [get_bd_pins slave/ref_clock] [get_bd_pins selectio_wiz_0/ref_clock]
connect_bd_net -net in_delay_reset1_1 [get_bd_pins xlconstant_0/dout] [get_bd_pins slave/in_delay_reset] [get_bd_pins selectio_wiz_0/in_delay_reset]
connect_bd_net [get_bd_pins xlconstant_1/dout] \
  [get_bd_pins slave/in_delay_data_ce] [get_bd_pins slave/in_delay_data_inc] [get_bd_pins selectio_wiz_0/in_delay_data_ce] \
  [get_bd_pins selectio_wiz_0/in_delay_data_inc]
connect_bd_net [get_bd_pins bitslip] [get_bd_pins slave/bitslip] [get_bd_pins selectio_wiz_0/bitslip]
connect_bd_net -net clk40_1 [get_bd_pins clk40] [get_bd_pins slave/clk_div_in] [get_bd_pins selectio_wiz_0/clk_div_in]
connect_bd_net -net data_in_from_pins1_1 [get_bd_pins data_in_from_pins1] [get_bd_pins slave/data_in_from_pins]
connect_bd_net -net in_delay_tap_in2_1 [get_bd_pins in_delay_tap_in2] [get_bd_pins slave/in_delay_tap_in]
connect_bd_net [get_bd_pins slave/data_in_to_device] [get_bd_pins data_in_to_device2]
connect_bd_net [get_bd_pins selectio_wiz_0/data_in_to_device] [get_bd_pins data_in_to_device]
connect_bd_net [get_bd_pins data_in_from_pins] [get_bd_pins selectio_wiz_0/data_in_from_pins]
connect_bd_net -net in_delay_tap_in1_1 [get_bd_pins in_delay_tap_in1] [get_bd_pins selectio_wiz_0/in_delay_tap_in]

current_bd_instance /TXD
connect_bd_intf_net -intf_net axi_clock_converter_1_M_AXI [get_bd_intf_pins clock_converter_SC_TRY/M_AXI] [get_bd_intf_pins SC_try_v1_0_0/s00_axi]
connect_bd_intf_net -intf_net output_fifo_AXI_STR_TXD [get_bd_intf_pins S_AXIS] [get_bd_intf_pins axis_clock_converter_1/S_AXIS]
connect_bd_intf_net [get_bd_intf_pins S_AXI] [get_bd_intf_pins tx_controller/S_AXI]
connect_bd_intf_net [get_bd_intf_pins S_AXI1] [get_bd_intf_pins clock_converter_SC_TRY/S_AXI]
connect_bd_net [get_bd_pins inverse_reverse_TX/data_out] [get_bd_pins TX_SERIALIZER/data_out_from_device]
connect_bd_net -net axis_clock_converter_0_m_axis_tdata [get_bd_pins axis_clock_converter_1/m_axis_tdata] [get_bd_pins xlslice_0/Din]
connect_bd_net [get_bd_pins xlslice_0/Dout] [get_bd_pins AP_Generator_0/data_in]
connect_bd_net -net axis_clock_converter_0_m_axis_tvalid [get_bd_pins axis_clock_converter_1/m_axis_tvalid] [get_bd_pins AP_Generator_0/datavalid]
connect_bd_net [get_bd_pins AP_Generator_0/data_out] [get_bd_pins tx_controller/data_in]
connect_bd_net -net clk_wiz_1_clk_out1 [get_bd_pins clk_in] [get_bd_pins TX_SERIALIZER/clk_in]
connect_bd_net -net CLK_40mhZ [get_bd_pins clk_40] \
  [get_bd_pins AP_Generator_0/clk] [get_bd_pins inverse_reverse_TX/clk] [get_bd_pins axis_clock_converter_1/m_axis_aclk] \
  [get_bd_pins TX_SERIALIZER/clk_div_in] [get_bd_pins clock_converter_SC_TRY/m_axi_aclk] \
  [get_bd_pins SC_try_v1_0_0/s00_axi_aclk] [get_bd_pins tx_controller/clk_40MHz]
connect_bd_net -net proc_sys_reset_1_peripheral_aresetn [get_bd_pins rst_n] \
  [get_bd_pins axis_clock_converter_1/s_axis_aresetn] [get_bd_pins clock_converter_SC_TRY/s_axi_aresetn] \
  [get_bd_pins tx_controller/m_axi_aresetn]
connect_bd_net -net microblaze_0_Clk [get_bd_pins s_axi_aclk] \
  [get_bd_pins axis_clock_converter_1/s_axis_aclk] [get_bd_pins clock_converter_SC_TRY/s_axi_aclk] \
  [get_bd_pins tx_controller/s_axi_aclk]
connect_bd_net -net BIST_OK_0_1 [get_bd_pins BIST_OK] [get_bd_pins tx_controller/BIST_OK_0]
connect_bd_net -net BIST_END_0_1 [get_bd_pins BIST_END] [get_bd_pins tx_controller/BIST_END_0]
connect_bd_net -net tx_controller_hier_BIST_START_0 [get_bd_pins tx_controller/BIST_START_0] [get_bd_pins BIST_START]
connect_bd_net -net tx_controller_hier_PS_ADC_ADDR [get_bd_pins tx_controller/PS_ADC_ADDR] [get_bd_pins PS_ADC_ADDR]
connect_bd_net -net tx_controller_hier_CALIB_ADC_ADDR [get_bd_pins tx_controller/CALIB_ADC_ADDR] [get_bd_pins CALIB_ADC_ADDR]
connect_bd_net -net tx_controller_hier_EXT_RST [get_bd_pins tx_controller/EXT_RST] [get_bd_pins EXT_RST]
connect_bd_net [get_bd_pins xlconstant_1/dout] [get_bd_pins inverse_reverse_TX/reverse]
connect_bd_net [get_bd_pins xlconstant_0/dout] [get_bd_pins axis_clock_converter_1/m_axis_tready]
connect_bd_net [get_bd_pins tx_controller/data_out] [get_bd_pins SC_try_v1_0_0/data_in]
connect_bd_net [get_bd_pins SC_try_v1_0_0/data_out] [get_bd_pins data_out] [get_bd_pins inverse_reverse_TX/data_in]
connect_bd_net -net m_axi_aresetn_1 [get_bd_pins aresetn_40MHz] \
  [get_bd_pins clock_converter_SC_TRY/m_axi_aresetn] [get_bd_pins SC_try_v1_0_0/s00_axi_aresetn] \
  [get_bd_pins axis_clock_converter_1/m_axis_aresetn] [get_bd_pins inverse_reverse_TX/rst_n] \
  [get_bd_pins AP_Generator_0/rst_n] [get_bd_pins tx_controller/aresetn_40MHz]
connect_bd_net [get_bd_pins S_to_diff_0/out_p] [get_bd_pins txd_p]
connect_bd_net [get_bd_pins S_to_diff_0/out_n] [get_bd_pins txd_n]
connect_bd_net [get_bd_pins TX_SERIALIZER/data_out_to_pins] [get_bd_pins S_to_diff_0/sig_in]
connect_bd_net [get_bd_pins xlconstant_2/dout] [get_bd_pins inverse_reverse_TX/invert]

current_bd_instance /TXD/tx_controller
connect_bd_intf_net [get_bd_intf_pins axi_clock_converter_1/M_AXI] [get_bd_intf_pins TX_CONTROLLER_SCURVE_0/s00_axi]
connect_bd_intf_net [get_bd_intf_pins S_AXI] [get_bd_intf_pins axi_clock_converter_1/S_AXI]
connect_bd_net -net microblaze_0_Clk [get_bd_pins s_axi_aclk] [get_bd_pins axi_clock_converter_1/s_axi_aclk]
connect_bd_net -net proc_sys_reset_1_peripheral_aresetn [get_bd_pins m_axi_aresetn] [get_bd_pins axi_clock_converter_1/s_axi_aresetn]
connect_bd_net [get_bd_pins clk_40MHz] [get_bd_pins axi_clock_converter_1/m_axi_aclk] [get_bd_pins TX_CONTROLLER_SCURVE_0/s00_axi_aclk]
connect_bd_net -net AP_Generator_0_data_out [get_bd_pins data_in] [get_bd_pins TX_CONTROLLER_SCURVE_0/data_in]
connect_bd_net -net BIST_OK_0_1 [get_bd_pins BIST_OK_0] [get_bd_pins TX_CONTROLLER_SCURVE_0/BIST_OK]
connect_bd_net -net BIST_END_0_1 [get_bd_pins BIST_END_0] [get_bd_pins TX_CONTROLLER_SCURVE_0/BIST_END]
connect_bd_net [get_bd_pins TX_CONTROLLER_SCURVE_0/BIST_START] [get_bd_pins BIST_START_0]
connect_bd_net [get_bd_pins TX_CONTROLLER_SCURVE_0/data_out] [get_bd_pins data_out]
connect_bd_net [get_bd_pins TX_CONTROLLER_SCURVE_0/PS_ADC_ADDR] [get_bd_pins PS_ADC_ADDR]
connect_bd_net [get_bd_pins TX_CONTROLLER_SCURVE_0/CALIB_ADC_ADDR] [get_bd_pins CALIB_ADC_ADDR]
connect_bd_net [get_bd_pins TX_CONTROLLER_SCURVE_0/EXT_RST] [get_bd_pins EXT_RST]
connect_bd_net [get_bd_pins aresetn_40MHz] [get_bd_pins axi_clock_converter_1/m_axi_aresetn] [get_bd_pins TX_CONTROLLER_SCURVE_0/s00_axi_aresetn]

current_bd_instance /dpa_hier
connect_bd_intf_net [get_bd_intf_pins dpa_controller_v1_0_0/s00_axi] [get_bd_intf_pins axi_clock_converter_1/M_AXI]
connect_bd_intf_net [get_bd_intf_pins S_AXI] [get_bd_intf_pins axi_clock_converter_1/S_AXI]
connect_bd_net [get_bd_pins s00_axi_aresetn] [get_bd_pins axi_clock_converter_1/m_axi_aresetn] [get_bd_pins dpa_controller_v1_0_0/s00_axi_aresetn]
connect_bd_net [get_bd_pins s00_axi_aclk] [get_bd_pins axi_clock_converter_1/m_axi_aclk] [get_bd_pins dpa_controller_v1_0_0/s00_axi_aclk]
connect_bd_net [get_bd_pins s_axi_aresetn] [get_bd_pins axi_clock_converter_1/s_axi_aresetn]
connect_bd_net [get_bd_pins s_axi_aclk] [get_bd_pins axi_clock_converter_1/s_axi_aclk]
connect_bd_net [get_bd_pins M_data] [get_bd_pins dpa_controller_v1_0_0/M_data]
connect_bd_net [get_bd_pins S_data] [get_bd_pins dpa_controller_v1_0_0/S_data]
connect_bd_net [get_bd_pins dpa_controller_v1_0_0/stap_pre] [get_bd_pins stap_pre]
connect_bd_net [get_bd_pins dpa_controller_v1_0_0/mtap_pre] [get_bd_pins mtap_pre]

current_bd_instance /trigger_logic_block
connect_bd_intf_net [get_bd_intf_pins axi_clock_converter_0/M_AXI] [get_bd_intf_pins Trigger_Bits_Controller_0/S00_AXI]
connect_bd_intf_net [get_bd_intf_pins S_AXI] [get_bd_intf_pins axi_clock_converter_0/S_AXI]
connect_bd_net [get_bd_pins xlconstant_0/dout] [get_bd_pins TU_TXD_BUS/in_delay_data_ce] [get_bd_pins TU_TXD_BUS/in_delay_data_inc]
connect_bd_net [get_bd_pins xlconstant_1/dout] [get_bd_pins TU_TXD_BUS/in_delay_reset] [get_bd_pins selectio_wiz_0/in_delay_reset]
connect_bd_net [get_bd_pins util_vector_logic_0/Res] [get_bd_pins TU_TXD_BUS/io_reset] [get_bd_pins selectio_wiz_0/io_reset]
connect_bd_net [get_bd_pins clk_in] [get_bd_pins TU_TXD_BUS/clk_in] [get_bd_pins selectio_wiz_0/clk_in]
connect_bd_net -net s_axi_aclk_0_1 [get_bd_pins s_axi_aclk] [get_bd_pins axi_clock_converter_0/s_axi_aclk]
connect_bd_net -net ref_clock_0_1 [get_bd_pins ref_clock] [get_bd_pins TU_TXD_BUS/ref_clock] [get_bd_pins selectio_wiz_0/ref_clock]
connect_bd_net [get_bd_pins clk_div_in] \
  [get_bd_pins TU_TXD_BUS/clk_div_in] [get_bd_pins axi_clock_converter_0/m_axi_aclk] [get_bd_pins selectio_wiz_0/clk_div_in] \
  [get_bd_pins Trigger_Bits_Controller_0/s00_axi_aclk]
connect_bd_net -net Op1_1 [get_bd_pins io_reset_n] [get_bd_pins util_vector_logic_0/Op1]
connect_bd_net [get_bd_pins m_axi_aresetn] [get_bd_pins axi_clock_converter_0/m_axi_aresetn] [get_bd_pins Trigger_Bits_Controller_0/s00_axi_aresetn]
connect_bd_net -net s_axi_aresetn_0_1 [get_bd_pins s_axi_aresetn] [get_bd_pins axi_clock_converter_0/s_axi_aresetn]
connect_bd_net -net data_in_from_pins_p_0_1 [get_bd_pins data_in_from_pins_p_0] [get_bd_pins TU_TXD_BUS/data_in_from_pins_p]
connect_bd_net -net data_in_from_pins_n_0_1 [get_bd_pins data_in_from_pins_n_0] [get_bd_pins TU_TXD_BUS/data_in_from_pins_n]
connect_bd_net -net data_in_from_pins_p_1_1 [get_bd_pins data_in_from_pins_p_1] [get_bd_pins selectio_wiz_0/data_in_from_pins_p]
connect_bd_net -net data_in_from_pins_n_1_1 [get_bd_pins data_in_from_pins_n_1] [get_bd_pins selectio_wiz_0/data_in_from_pins_n]
connect_bd_net [get_bd_pins xlconstant_2/dout] [get_bd_pins selectio_wiz_0/in_delay_data_ce] [get_bd_pins selectio_wiz_0/in_delay_data_inc]
connect_bd_net -net Trigger_Bits_Controller_0_delay_tap_bus [get_bd_pins Trigger_Bits_Controller_0/delay_tap_tu] \
  [get_bd_pins TU_TXD_BUS/in_delay_tap_in]
connect_bd_net [get_bd_pins Trigger_Bits_Controller_0/delay_tap_sot] [get_bd_pins selectio_wiz_0/in_delay_tap_in]
connect_bd_net -net Trigger_Bits_Controller_0_bitslip_sot [get_bd_pins Trigger_Bits_Controller_0/sot_bitslip] [get_bd_pins selectio_wiz_0/bitslip]
connect_bd_net -net Trigger_Bits_Controller_0_bitslip_bus [get_bd_pins Trigger_Bits_Controller_0/tu_bitslip] [get_bd_pins TU_TXD_BUS/bitslip]
connect_bd_net [get_bd_pins selectio_wiz_0/data_in_to_device] [get_bd_pins Trigger_Bits_Controller_0/data_in_sot]
connect_bd_net [get_bd_pins TU_TXD_BUS/data_in_to_device] [get_bd_pins Trigger_Bits_Controller_0/trigger_data_in]

current_bd_instance /
connect_bd_intf_net [get_bd_intf_pins microblaze_0/DLMB] [get_bd_intf_pins microblaze_0_local_memory/DLMB]
connect_bd_intf_net [get_bd_intf_pins microblaze_0/ILMB] [get_bd_intf_pins microblaze_0_local_memory/ILMB]
connect_bd_intf_net -intf_net microblaze_0_axi_dp [get_bd_intf_pins microblaze_0_axi_periph/S00_AXI] [get_bd_intf_pins microblaze_0/M_AXI_DP]
connect_bd_intf_net [get_bd_intf_pins microblaze_0_axi_intc/interrupt] [get_bd_intf_pins microblaze_0/INTERRUPT]
connect_bd_intf_net -intf_net microblaze_0_intc_axi [get_bd_intf_pins microblaze_0_axi_periph/M00_AXI] [get_bd_intf_pins microblaze_0_axi_intc/s_axi]
connect_bd_intf_net [get_bd_intf_pins microblaze_0_axi_periph/M01_AXI] [get_bd_intf_pins axi_timer_0/S_AXI]
connect_bd_intf_net [get_bd_intf_pins microblaze_0_axi_periph/M02_AXI] [get_bd_intf_pins axi_uartlite_0/S_AXI]
connect_bd_intf_net [get_bd_intf_pins axi_bram_ctrl_0/BRAM_PORTA] [get_bd_intf_pins blk_mem_gen_0/BRAM_PORTA]
connect_bd_intf_net [get_bd_intf_pins axi_bram_ctrl_0/BRAM_PORTB] [get_bd_intf_pins blk_mem_gen_0/BRAM_PORTB]
connect_bd_intf_net [get_bd_intf_pins axi_mem_intercon/M00_AXI] [get_bd_intf_pins mig_7series_0/S_AXI]
connect_bd_intf_net [get_bd_intf_pins axi_mem_intercon/M01_AXI] [get_bd_intf_pins axi_bram_ctrl_0/S_AXI]
connect_bd_intf_net [get_bd_intf_pins axi_ethernet_0_dma/M_AXIS_MM2S] [get_bd_intf_pins axi_ethernet_0/s_axis_txd]
connect_bd_intf_net [get_bd_intf_pins axi_ethernet_0_dma/M_AXIS_CNTRL] [get_bd_intf_pins axi_ethernet_0/s_axis_txc]
connect_bd_intf_net [get_bd_intf_pins axi_ethernet_0_dma/S_AXIS_STS] [get_bd_intf_pins axi_ethernet_0/m_axis_rxs]
connect_bd_intf_net [get_bd_intf_pins axi_ethernet_0_dma/S_AXIS_S2MM] [get_bd_intf_pins axi_ethernet_0/m_axis_rxd]
connect_bd_intf_net [get_bd_intf_pins axi_ethernet_0_dma/M_AXI_SG] [get_bd_intf_pins axi_mem_intercon/S02_AXI]
connect_bd_intf_net [get_bd_intf_pins microblaze_0_axi_periph/M03_AXI] [get_bd_intf_pins axi_ethernet_0_dma/S_AXI_LITE]
connect_bd_intf_net [get_bd_intf_pins axi_ethernet_0_dma/M_AXI_S2MM] [get_bd_intf_pins axi_mem_intercon/S03_AXI]
connect_bd_intf_net [get_bd_intf_pins axi_ethernet_0_dma/M_AXI_MM2S] [get_bd_intf_pins axi_mem_intercon/S04_AXI]
connect_bd_intf_net [get_bd_intf_pins microblaze_0_axi_periph/M04_AXI] [get_bd_intf_pins axi_ethernet_0/s_axi]
connect_bd_intf_net [get_bd_intf_pins bit_slip/S_AXI] [get_bd_intf_pins axi_clock_converter_0/M_AXI]
connect_bd_intf_net -intf_net Receiver_logic_M_AXIS [get_bd_intf_pins RXD/M_AXIS] [get_bd_intf_pins FIFO/AXI_STR_RXD]
connect_bd_intf_net [get_bd_intf_pins microblaze_0_axi_periph/M05_AXI] [get_bd_intf_pins FIFO/S_AXI]
connect_bd_intf_net -intf_net output_fifo_AXI_STR_TXD [get_bd_intf_pins FIFO/AXI_STR_TXD] [get_bd_intf_pins TXD/S_AXIS]
connect_bd_intf_net [get_bd_intf_pins microblaze_0_axi_periph/M07_AXI] [get_bd_intf_pins axi_iic_0/S_AXI]
connect_bd_intf_net [get_bd_intf_pins microblaze_0/DEBUG] [get_bd_intf_pins mdm_1/MBDEBUG_0]
connect_bd_intf_net [get_bd_intf_pins microblaze_0_axi_periph/M08_AXI] [get_bd_intf_pins FIFO/S_AXI_FULL]
connect_bd_intf_net [get_bd_intf_pins TXD/S_AXI] [get_bd_intf_pins microblaze_0_axi_periph/M09_AXI]
connect_bd_intf_net [get_bd_intf_pins microblaze_0/M_AXI_DC] [get_bd_intf_pins axi_mem_intercon/S00_AXI]
connect_bd_intf_net [get_bd_intf_pins microblaze_0/M_AXI_IC] [get_bd_intf_pins axi_mem_intercon/S01_AXI]
connect_bd_intf_net [get_bd_intf_pins axi_clock_converter_0/S_AXI] [get_bd_intf_pins microblaze_0_axi_periph/M10_AXI]
connect_bd_intf_net [get_bd_intf_pins axi_quad_spi_0/AXI_LITE] [get_bd_intf_pins microblaze_0_axi_periph/M12_AXI]
connect_bd_intf_net [get_bd_intf_pins microblaze_0_axi_periph/M11_AXI] [get_bd_intf_pins RXD/S_AXI]
connect_bd_intf_net [get_bd_intf_pins microblaze_0_axi_periph/M14_AXI] [get_bd_intf_pins TXD/S_AXI1]
connect_bd_intf_net [get_bd_intf_pins microblaze_0_axi_periph/M13_AXI] [get_bd_intf_pins dpa_hier/S_AXI]
connect_bd_intf_net [get_bd_intf_pins microblaze_0_axi_periph/M15_AXI] [get_bd_intf_pins success_master/S_AXI]
connect_bd_intf_net [get_bd_intf_pins trigger_logic_block/S_AXI] [get_bd_intf_pins microblaze_0_axi_periph/M16_AXI]
connect_bd_intf_net [get_bd_intf_ports rs232_uart] [get_bd_intf_pins axi_uartlite_0/UART]
connect_bd_intf_net [get_bd_intf_ports DDR3] [get_bd_intf_pins mig_7series_0/DDR3]
connect_bd_intf_net [get_bd_intf_ports gmii] [get_bd_intf_pins axi_ethernet_0/gmii]
connect_bd_intf_net [get_bd_intf_ports mdio_mdc] [get_bd_intf_pins axi_ethernet_0/mdio]
connect_bd_intf_net [get_bd_intf_ports iic_main] [get_bd_intf_pins axi_iic_0/IIC]
connect_bd_intf_net [get_bd_intf_ports spi_flash] [get_bd_intf_pins axi_quad_spi_0/SPI_0]
connect_bd_net -net microblaze_0_intr [get_bd_pins microblaze_0_xlconcat/dout] [get_bd_pins microblaze_0_axi_intc/intr]
connect_bd_net -net microblaze_0_Clk [get_bd_pins mig_7series_0/ui_clk] \
  [get_bd_pins microblaze_0_axi_intc/s_axi_aclk] [get_bd_pins microblaze_0_axi_intc/processor_clk] \
  [get_bd_pins axi_bram_ctrl_0/s_axi_aclk] [get_bd_pins axi_clock_converter_0/s_axi_aclk] \
  [get_bd_pins axi_ethernet_0/s_axi_lite_clk] [get_bd_pins axi_ethernet_0/axis_clk] \
  [get_bd_pins axi_ethernet_0_dma/s_axi_lite_aclk] [get_bd_pins axi_ethernet_0_dma/m_axi_sg_aclk] \
  [get_bd_pins axi_ethernet_0_dma/m_axi_mm2s_aclk] [get_bd_pins axi_ethernet_0_dma/m_axi_s2mm_aclk] \
  [get_bd_pins FIFO/s_axi_aclk] [get_bd_pins axi_iic_0/s_axi_aclk] [get_bd_pins axi_timer_0/s_axi_aclk] \
  [get_bd_pins axi_uartlite_0/s_axi_aclk] [get_bd_pins microblaze_0/Clk] [get_bd_pins proc_sys_reset_1/slowest_sync_clk] \
  [get_bd_pins axi_quad_spi_0/s_axi_aclk] [get_bd_pins success_master/s_axi_aclk] \
  [get_bd_pins microblaze_0_local_memory/LMB_Clk] [get_bd_pins axi_mem_intercon/ACLK] [get_bd_pins axi_mem_intercon/S00_ACLK] \
  [get_bd_pins axi_mem_intercon/S01_ACLK] [get_bd_pins axi_mem_intercon/S02_ACLK] [get_bd_pins axi_mem_intercon/S03_ACLK] \
  [get_bd_pins axi_mem_intercon/S04_ACLK] [get_bd_pins axi_mem_intercon/M00_ACLK] [get_bd_pins axi_mem_intercon/M01_ACLK] \
  [get_bd_pins microblaze_0_axi_periph/ACLK] [get_bd_pins microblaze_0_axi_periph/S00_ACLK] \
  [get_bd_pins microblaze_0_axi_periph/M00_ACLK] [get_bd_pins microblaze_0_axi_periph/M01_ACLK] \
  [get_bd_pins microblaze_0_axi_periph/M02_ACLK] [get_bd_pins microblaze_0_axi_periph/M03_ACLK] \
  [get_bd_pins microblaze_0_axi_periph/M04_ACLK] [get_bd_pins microblaze_0_axi_periph/M05_ACLK] \
  [get_bd_pins microblaze_0_axi_periph/M06_ACLK] [get_bd_pins microblaze_0_axi_periph/M07_ACLK] \
  [get_bd_pins microblaze_0_axi_periph/M08_ACLK] [get_bd_pins microblaze_0_axi_periph/M09_ACLK] \
  [get_bd_pins microblaze_0_axi_periph/M10_ACLK] [get_bd_pins microblaze_0_axi_periph/M11_ACLK] \
  [get_bd_pins microblaze_0_axi_periph/M12_ACLK] [get_bd_pins microblaze_0_axi_periph/M13_ACLK] [get_bd_pins RXD/m_axis_aclk] \
  [get_bd_pins TXD/s_axi_aclk] [get_bd_pins microblaze_0_axi_periph/M14_ACLK] [get_bd_pins microblaze_0_axi_periph/M15_ACLK] \
  [get_bd_pins microblaze_0_axi_periph/M16_ACLK] [get_bd_pins dpa_hier/s_axi_aclk] \
  [get_bd_pins trigger_logic_block/s_axi_aclk]
connect_bd_net [get_bd_pins proc_sys_reset_1/bus_struct_reset] [get_bd_pins microblaze_0_local_memory/LMB_Rst]
connect_bd_net [get_bd_pins mdm_1/Debug_SYS_Rst] [get_bd_pins proc_sys_reset_1/mb_debug_sys_rst]
connect_bd_net [get_bd_pins proc_sys_reset_1/peripheral_aresetn] \
  [get_bd_pins microblaze_0_axi_intc/s_axi_aresetn] [get_bd_pins axi_bram_ctrl_0/s_axi_aresetn] \
  [get_bd_pins axi_clock_converter_0/s_axi_aresetn] [get_bd_pins axi_ethernet_0/s_axi_lite_resetn] \
  [get_bd_pins axi_ethernet_0_dma/axi_resetn] [get_bd_pins FIFO/s_axi_aresetn] [get_bd_pins axi_iic_0/s_axi_aresetn] \
  [get_bd_pins axi_timer_0/s_axi_aresetn] [get_bd_pins axi_uartlite_0/s_axi_aresetn] [get_bd_pins mig_7series_0/aresetn] \
  [get_bd_pins axi_quad_spi_0/s_axi_aresetn] [get_bd_pins success_master/s_axi_aresetn] \
  [get_bd_pins axi_mem_intercon/S00_ARESETN] [get_bd_pins axi_mem_intercon/S01_ARESETN] \
  [get_bd_pins axi_mem_intercon/S02_ARESETN] [get_bd_pins axi_mem_intercon/S03_ARESETN] \
  [get_bd_pins axi_mem_intercon/S04_ARESETN] [get_bd_pins axi_mem_intercon/M00_ARESETN] \
  [get_bd_pins axi_mem_intercon/M01_ARESETN] [get_bd_pins microblaze_0_axi_periph/S00_ARESETN] \
  [get_bd_pins microblaze_0_axi_periph/M00_ARESETN] [get_bd_pins microblaze_0_axi_periph/M01_ARESETN] \
  [get_bd_pins microblaze_0_axi_periph/M02_ARESETN] [get_bd_pins microblaze_0_axi_periph/M03_ARESETN] \
  [get_bd_pins microblaze_0_axi_periph/M04_ARESETN] [get_bd_pins microblaze_0_axi_periph/M05_ARESETN] \
  [get_bd_pins microblaze_0_axi_periph/M06_ARESETN] [get_bd_pins microblaze_0_axi_periph/M07_ARESETN] \
  [get_bd_pins microblaze_0_axi_periph/M08_ARESETN] [get_bd_pins microblaze_0_axi_periph/M09_ARESETN] \
  [get_bd_pins microblaze_0_axi_periph/M10_ARESETN] [get_bd_pins microblaze_0_axi_periph/M11_ARESETN] \
  [get_bd_pins microblaze_0_axi_periph/M12_ARESETN] [get_bd_pins microblaze_0_axi_periph/M13_ARESETN] [get_bd_pins RXD/rst_n] \
  [get_bd_pins TXD/rst_n] [get_bd_pins microblaze_0_axi_periph/M14_ARESETN] [get_bd_pins microblaze_0_axi_periph/M15_ARESETN] \
  [get_bd_pins microblaze_0_axi_periph/M16_ARESETN] [get_bd_pins dpa_hier/s_axi_aresetn] \
  [get_bd_pins trigger_logic_block/s_axi_aresetn]
connect_bd_net [get_bd_pins proc_sys_reset_1/mb_reset] [get_bd_pins microblaze_0_axi_intc/processor_rst] [get_bd_pins microblaze_0/Reset]
connect_bd_net [get_bd_pins mig_7series_0/ui_clk_sync_rst] [get_bd_pins proc_sys_reset_1/ext_reset_in] [get_bd_pins proc_sys_reset_0/ext_reset_in]
connect_bd_net [get_bd_pins axi_timer_0/interrupt] [get_bd_pins microblaze_0_xlconcat/In4]
connect_bd_net [get_bd_pins axi_uartlite_0/interrupt] [get_bd_pins microblaze_0_xlconcat/In3]
connect_bd_net [get_bd_ports sys_clk_p] [get_bd_pins mig_7series_0/sys_clk_p]
connect_bd_net [get_bd_ports sys_clk_n] [get_bd_pins mig_7series_0/sys_clk_n]
connect_bd_net [get_bd_ports reset] [get_bd_pins clk_wiz_0/reset] [get_bd_pins clk_wiz_1/reset] [get_bd_pins mig_7series_0/sys_rst]
connect_bd_net [get_bd_pins axi_ethernet_0_dma/mm2s_prmry_reset_out_n] [get_bd_pins axi_ethernet_0/axi_txd_arstn]
connect_bd_net [get_bd_pins axi_ethernet_0_dma/mm2s_cntrl_reset_out_n] [get_bd_pins axi_ethernet_0/axi_txc_arstn]
connect_bd_net [get_bd_pins axi_ethernet_0_dma/s2mm_prmry_reset_out_n] [get_bd_pins axi_ethernet_0/axi_rxd_arstn]
connect_bd_net [get_bd_pins axi_ethernet_0_dma/s2mm_sts_reset_out_n] [get_bd_pins axi_ethernet_0/axi_rxs_arstn]
connect_bd_net [get_bd_pins axi_ethernet_0/phy_rst_n] [get_bd_ports phy_reset_out]
connect_bd_net [get_bd_pins axi_ethernet_0_dma/mm2s_introut] [get_bd_pins microblaze_0_xlconcat/In2]
connect_bd_net [get_bd_pins axi_ethernet_0_dma/s2mm_introut] [get_bd_pins microblaze_0_xlconcat/In1]
connect_bd_net [get_bd_pins axi_ethernet_0/interrupt] [get_bd_pins microblaze_0_xlconcat/In0]
connect_bd_net [get_bd_pins mig_7series_0/ui_addn_clk_0] [get_bd_pins axi_ethernet_0/ref_clk]
connect_bd_net [get_bd_pins mig_7series_0/ui_addn_clk_1] [get_bd_pins clk_wiz_0/clk_in1] [get_bd_pins clk_wiz_1/clk_in1]
connect_bd_net -net clk_320MHz [get_bd_pins clk_wiz_1/clk_out1] \
  [get_bd_pins S_to_diff_1/sig_in] [get_bd_pins RXD/clk_in] [get_bd_pins TXD/clk_in] [get_bd_pins trigger_logic_block/clk_in]
connect_bd_net -net Receiver_logic_gpio_io_o1 [get_bd_pins bit_slip/gpio_io_o] [get_bd_pins RXD/bitslip_ena]
connect_bd_net -net S_to_diff_0_out_p [get_bd_pins TXD/txd_p] [get_bd_ports vfat3_txd_p]
connect_bd_net -net S_to_diff_0_out_n [get_bd_pins TXD/txd_n] [get_bd_ports vfat3_txd_n]
connect_bd_net [get_bd_pins axi_iic_0/iic2intc_irpt] [get_bd_pins microblaze_0_xlconcat/In5]
connect_bd_net -net BIST_OK_0_1 [get_bd_ports BIST_OK] [get_bd_pins TXD/BIST_OK]
connect_bd_net -net BIST_END_0_1 [get_bd_ports BIST_END] [get_bd_pins TXD/BIST_END]
connect_bd_net -net tx_controller_hier_BIST_START_0 [get_bd_pins TXD/BIST_START] [get_bd_ports BIST_START]
connect_bd_net [get_bd_pins xlconstant_3/dout] [get_bd_pins RXD/reverse]
connect_bd_net -net tx_controller_hier_PS_ADC_ADDR [get_bd_pins TXD/PS_ADC_ADDR] [get_bd_ports PS_ADC_ADDR]
connect_bd_net -net tx_controller_hier_CALIB_ADC_ADDR [get_bd_pins TXD/CALIB_ADC_ADDR] [get_bd_ports CALIB_ADC_ADDR]
connect_bd_net -net tx_controller_hier_EXT_RST [get_bd_pins TXD/EXT_RST] [get_bd_ports EXT_RST]
connect_bd_net [get_bd_pins clk_wiz_0/clk_out2] \
  [get_bd_pins idelayctrl_inst/ref_clk] [get_bd_pins RXD/ref_clock] [get_bd_pins trigger_logic_block/ref_clock]
connect_bd_net [get_bd_pins mig_7series_0/ui_addn_clk_2] \
  [get_bd_pins proc_sys_reset_0/slowest_sync_clk] [get_bd_pins axi_clock_converter_0/m_axi_aclk] \
  [get_bd_pins bit_slip/s_axi_aclk] [get_bd_pins RXD/clk40] [get_bd_pins TXD/clk_40] [get_bd_pins dpa_hier/s00_axi_aclk] \
  [get_bd_pins trigger_logic_block/clk_div_in]
connect_bd_net [get_bd_pins mig_7series_0/mmcm_locked] [get_bd_pins proc_sys_reset_0/dcm_locked] [get_bd_pins proc_sys_reset_1/dcm_locked]
connect_bd_net [get_bd_pins proc_sys_reset_0/interconnect_aresetn] \
  [get_bd_pins axi_clock_converter_0/m_axi_aresetn] [get_bd_pins bit_slip/s_axi_aresetn] \
  [get_bd_pins RXD/s00_axi_aresetn_40MHz] [get_bd_pins TXD/aresetn_40MHz] [get_bd_pins dpa_hier/s00_axi_aresetn] \
  [get_bd_pins trigger_logic_block/m_axi_aresetn]
connect_bd_net [get_bd_pins S_to_diff_1/out_p] [get_bd_ports rxclk_p]
connect_bd_net [get_bd_pins S_to_diff_1/out_n] [get_bd_ports rxclk_n]
connect_bd_net [get_bd_pins RXD/data_in_to_device] [get_bd_pins dpa_hier/M_data]
connect_bd_net [get_bd_pins dpa_hier/mtap_pre] [get_bd_pins RXD/in_delay_tap_in1]
connect_bd_net [get_bd_pins proc_sys_reset_0/peripheral_reset] [get_bd_pins idelayctrl_inst/rst] [get_bd_pins RXD/io_reset]
